# Altium project Adjustable Led Driver on LM-317 (6 ports).PrjPcb
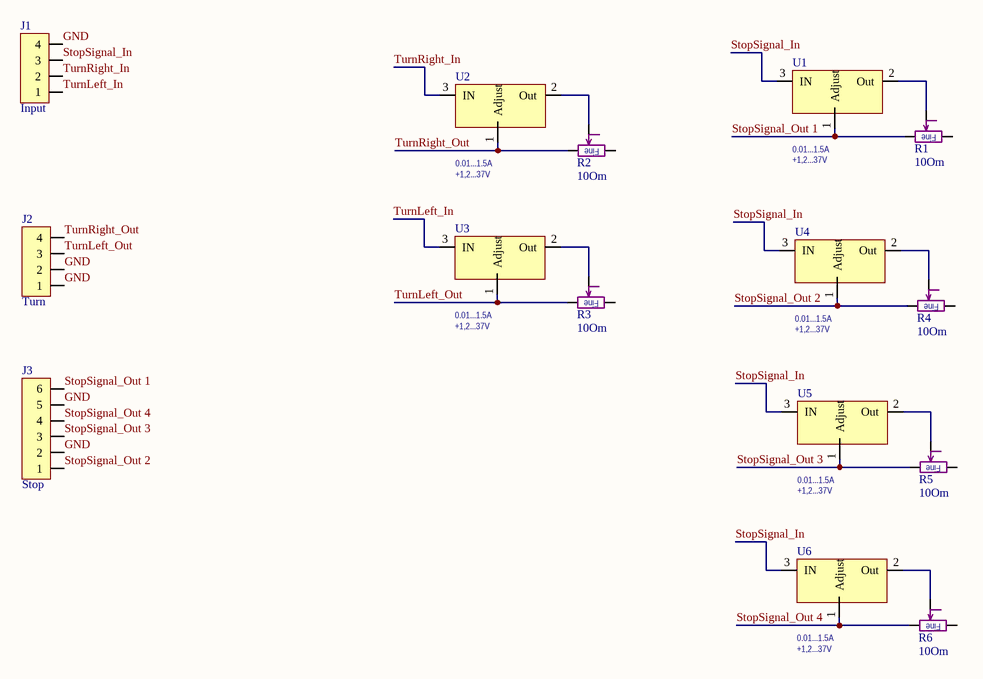
[diagram p0: Adjustable Led Driver on LM-317 (6 ports).SchDoc]
1 sheet, 15 parts. Net scope: global (net labels, ports and power ports of the same name join across sheets).
Board files: Adjustable Led Driver on LM-317 (6 ports).PcbDoc, Adjustable Led Driver on LM-317 (6 ports) compact.PcbDoc

## Sheet Adjustable Led Driver on LM-317 (6 ports).SchDoc: Adjustable Led Driver on LM-317
size A4; Version: 1.0; Variant: 6 Ports; Modification: Mod; Project: Light Control

### Parts
J1  Input  [Molex Micro-Fit 3.0 - 4 pin D R]
J2  Turn  [Molex Micro-Fit 3.0 - 4 pin D R]
J3  Stop  [Molex Micro-Fit 3.0 - 6 pin D R]
R1  10Om  [Res Adj 2.54 X 3]
R2  10Om  [Res Adj 2.54 X 3]
R3  10Om  [Res Adj 2.54 X 3]
R4  10Om  [Res Adj 2.54 X 3]
R5  10Om  [Res Adj 2.54 X 3]
R6  10Om  [Res Adj 2.54 X 3]
U1  I output (A) Adjustable: 0.01...1.5A  V Out: +1,2...37V  [TO220-2]
U2  I output (A) Adjustable: 0.01...1.5A  V Out: +1,2...37V  [TO220-2]
U3  I output (A) Adjustable: 0.01...1.5A  V Out: +1,2...37V  [TO220-2]
U4  I output (A) Adjustable: 0.01...1.5A  V Out: +1,2...37V  [TO220-2]
U5  I output (A) Adjustable: 0.01...1.5A  V Out: +1,2...37V  [TO220-2]
U6  I output (A) Adjustable: 0.01...1.5A  V Out: +1,2...37V  [TO220-2]

### Nets
GND: J1.4 J2.1 J2.2 J3.2 J3.5
StopSignal_In: J1.3 U1.3(IN) U4.3(IN) U5.3(IN) U6.3(IN)
StopSignal_Out 1: J3.6 R1.3 U1.1(Adjust)
StopSignal_Out 2: J3.1 R4.3 U4.1(Adjust)
StopSignal_Out 3: J3.3 R5.3 U5.1(Adjust)
StopSignal_Out 4: J3.4 R6.3 U6.1(Adjust)
TurnLeft_In: J1.1 U3.3(IN)
TurnLeft_Out: J2.3 R3.3 U3.1(Adjust)
TurnRight_In: J1.2 U2.3(IN)
TurnRight_Out: J2.4 R2.3 U2.1(Adjust)
NetR1_2: R1.2 U1.2(Out)
NetR2_2: R2.2 U2.2(Out)
NetR3_2: R3.2 U3.2(Out)
NetR4_2: R4.2 U4.2(Out)
NetR5_2: R5.2 U5.2(Out)
NetR6_2: R6.2 U6.2(Out)

Not connected (* = marked no-connect by the designer): R1 1; R2 1; R3 1; R4 1; R5 1; R6 1

### Notes on the sheet
- Ver:
- Rev:
- Sheet
- of
- File:
- (in symbol Res Adj 3296) Fine

### Library data of the parts
J1 J2 = Micro-Fit 4R (2x2): Horisontal, Dbl line, Male - 3mm; Part Number: 0430450402; Name: Micro-Fit 3.0; URL: http://www.molex.com/molex/products/datasheet.jsp?part=active/0430450402_PCB_HEADERS.xml
J3 = Micro-Fit 6R (2x3): Horisontal, Dbl line, Male - 3mm
R1-R6 = Res Adj 3296
U1-U6 = LM-317: Voltage Regulator; Напряжение выход-вход (dropout): 2 v; Case: TO-220; Datasheet: http://www.ti.com/lit/ds/symlink/lm317.pdf